# EasyEDA Pro project BEI Kimco Magnetic Cylindrical Frameless Linear Voice Coil Actuator LA15-16-020A.eprj, schematic Schematic1
Board Name: Board1; Create Date: 2025-06-06; Page Name: P1; Project Name: BEI Kimco Magnetic Cylindrical Frameless Linear Voice Coil Actuator LA15-16-020A; Schematic Name: Schematic1; Update Date: 2025-06-13; Company: EasyEDA.com; Page Size: A4; Version: V1.0
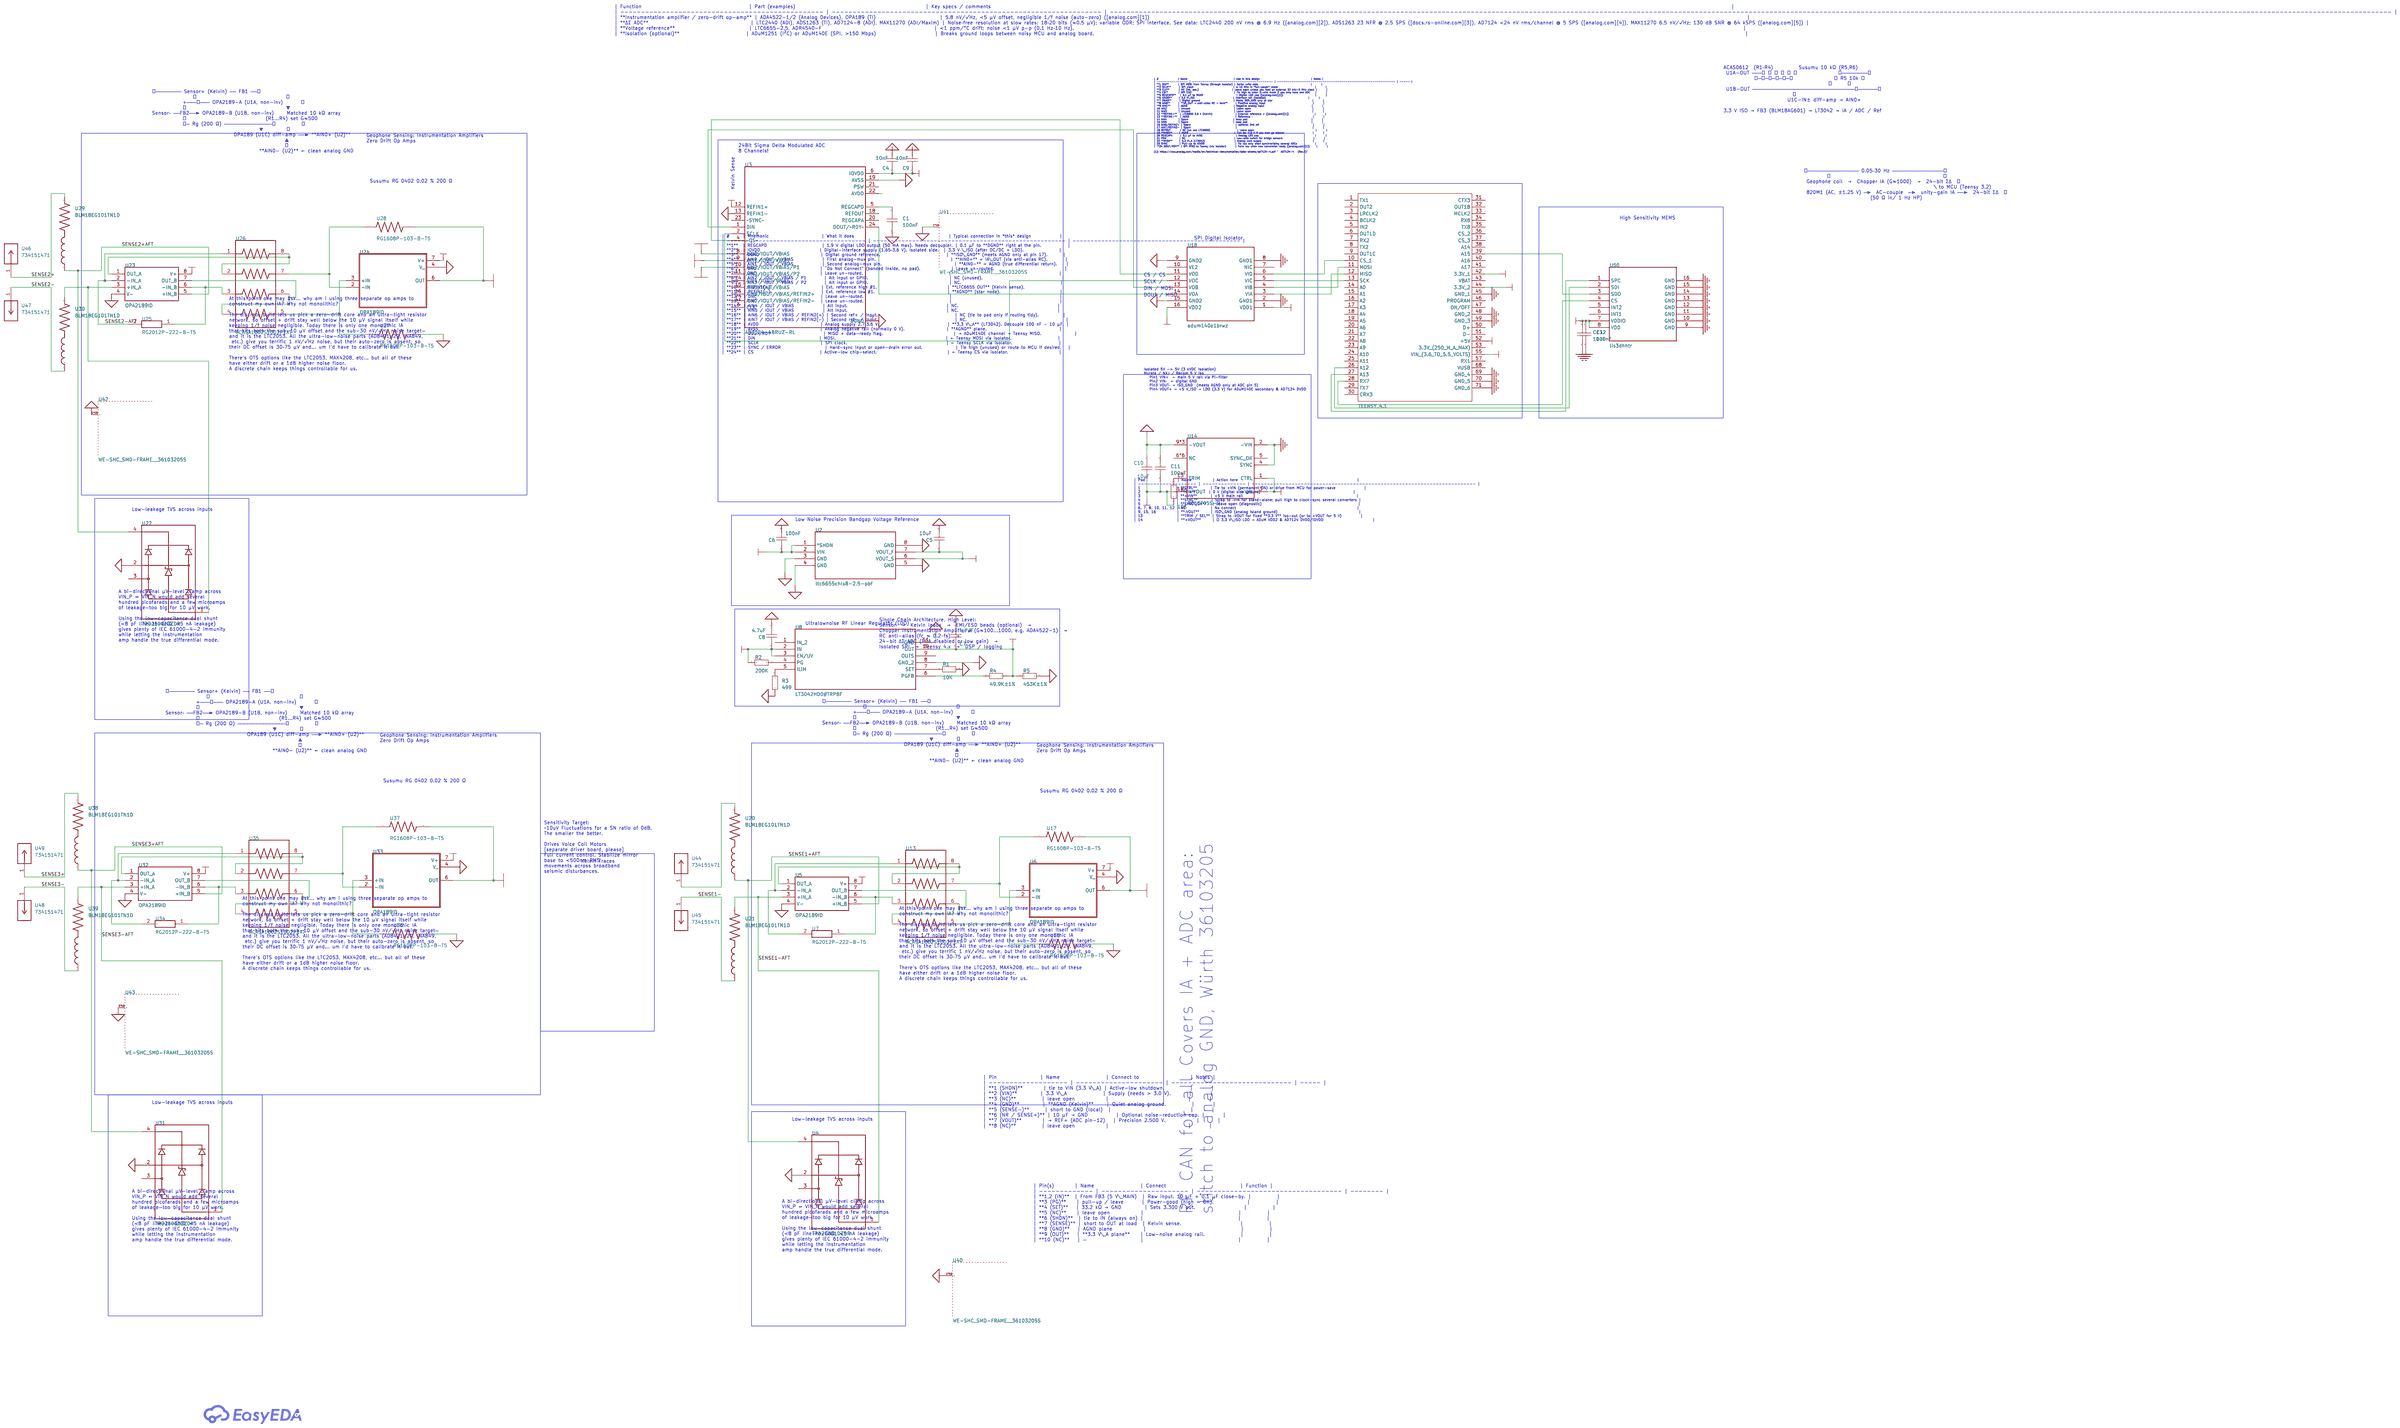
[diagram p0: schematic sheet]

## Parts
C1  100nF  [C0603]
C4  10nF  [C0603]
C5  10uF  [C0603]
C6  100nF  [C0603]
C7  4.7uF  [C0603]
C8  4.7uF  [C0603]
C9  10nF  [C0603]
C10  10uF  [C0603]
C11  100nF  [C0603]
C12  100nF  [C0603]
C13  10uF  [C0603]
R1  10K  [R0603]
R2  200K  [R0603]
R3  499  [R0603]
R4  49.9K±1%  [R0603]
R5  453K±1%  [R0603]
R6  10K  [R0603]
U2  ltc6655chls8-2.5-pbf  [LTC6655CHLS8-2.5-PBF]
U3  AD7124-4BRUZ-RL  [SOP65P640X120-24N]
U4  TPD2E001DZDR  [SOT192P237X122-4N]
U5  OPA2189ID  [SOIC127P600X175-8N]
U6  OPA189ID  [SOIC127P599X175-8N]
U7  RG2012P-222-B-T5  [RESC2012X50N]
U8  LT3042HDD#TRPBF  [DFN-10_DD]
U13  ACASA1002S1002P1AT  [RESCAXS80P320X150X55-8N]
U14  R05CT05S-R  [SOIC127P1030X265-16N]
U16  RG1608P-103-B-T5  [RESC1608X50N]
U17  RG1608P-103-B-T5  [RESC1608X50N]
U18  adum140e1brwz  [ADUM140E1BRWZ]
U20  BLM18EG101TN1D  [BEADC1608X65N]
U21  BLM18EG101TN1D  [BEADC1608X65N]
U22  TPD2E001DZDR  [SOT192P237X122-4N]
U23  OPA2189ID  [SOIC127P600X175-8N]
U24  OPA189ID  [SOIC127P599X175-8N]
U25  RG2012P-222-B-T5  [RESC2012X50N]
U26  ACASA1002S1002P1AT  [RESCAXS80P320X150X55-8N]
U27  RG1608P-103-B-T5  [RESC1608X50N]
U28  RG1608P-103-B-T5  [RESC1608X50N]
U29  BLM18EG101TN1D  [BEADC1608X65N]
U30  BLM18EG101TN1D  [BEADC1608X65N]
U31  TPD2E001DZDR  [SOT192P237X122-4N]
U32  OPA2189ID  [SOIC127P600X175-8N]
U33  OPA189ID  [SOIC127P599X175-8N]
U34  RG2012P-222-B-T5  [RESC2012X50N]
U35  ACASA1002S1002P1AT  [RESCAXS80P320X150X55-8N]
U36  RG1608P-103-B-T5  [RESC1608X50N]
U37  RG1608P-103-B-T5  [RESC1608X50N]
U38  BLM18EG101TN1D  [BEADC1608X65N]
U39  BLM18EG101TN1D  [BEADC1608X65N]
U40  WE-SHC_SMD-FRAME__36103205S  [WE-SHC_SMD-FRAME_36103205S]
U41  WE-SHC_SMD-FRAME__36103205S  [WE-SHC_SMD-FRAME_36103205S]
U42  WE-SHC_SMD-FRAME__36103205S  [WE-SHC_SMD-FRAME_36103205S]
U43  WE-SHC_SMD-FRAME__36103205S  [WE-SHC_SMD-FRAME_36103205S]
U44  734151471  [CONN_734151471_MOL]
U45  734151471  [CONN_734151471_MOL]
U46  734151471  [CONN_734151471_MOL]
U47  734151471  [CONN_734151471_MOL]
U48  734151471  [CONN_734151471_MOL]
U49  734151471  [CONN_734151471_MOL]
U50  lis3dhhtr  [LIS3DHHTR]
U51  TEENSY_4.1  [TEENSY41]

## Library data of the parts
C1 C4-C13 = CAP_0603: Supplier Footprint: 0603
R1-R6 = Res_0603: Supplier Footprint: 0603
U2 = ltc6655chls8-2.5-pbf
U3 = AD7124-4BRUZ-RL
U4 U22 U31 = TPD2E001DZDR
U5 U23 U32 = OPA2189ID
U6 U24 U33 = OPA189ID
U7 U25 U34 = RG2012P-222-B-T5
U8 = LT3042HDD#TRPBF
U13 U26 U35 = ACASA1002S1002P1AT
U14 = R05CT05S-R
U16 U17 U27 U28 U36 U37 = RG1608P-103-B-T5
U18 = adum140e1brwz
U20 U21 U29 U30 U38 U39 = BLM18EG101TN1D
U40-U43 = WE-SHC_SMD-FRAME__36103205S
U44-U49 = 734151471
U50 = lis3dhhtr
U51 = TEENSY_4.1

## Nets
+2.5V: C5.2 U2.6(VOUT_S) U2.7(VOUT_F) U3.12(REFIN1+)
+3.3V_D: C12.2 C13.2 U18.1(VDD1) U50.7(VDDIO) U50.8(VDD) U51.42(3.3V_1) U51.44(3.3V_2)
+3.3VANALOGSIDE: C4.1 C6.2 C7.2 C9.1 R4.2 R5.1 U2.1(*SHDN) U2.2(VIN) U3.6(IOVDD) U5.8(V+) U6.7(V+) U8.10(OUT) U18.16(VDD2) U23.8(V+) U24.7(V+) U32.8(V+) U33.7(V+)
+5V_D: U14.1(CTRL) U14.3(+VIN) U51.52(+5V) U51.55(VIN_(3.6_TO_5.5_VOLTS))
+5V_ISO: C8.2 C10.1 C11.1 R2.1 R6.1 U8.2(IN) U8.3(EN/UV) U14.14(+VOUT)
AGND: C1.2 C4.2 C5.1 C6.1 C7.1 C8.1 C9.2 C10.2 C11.2 R1.2 R3.1 R5.2 U2.3(GND) U2.4(GND) U2.5(GND) U2.8(GND) U3.7(DGND) U3.13(REFIN1-) U3.19(AVSS) U4.2(IO1) U5.4(V-) U6.4(V_) U8.8(GND_2) U8.11(GND) U14.9*3(-VOUT) U16.2 U18.9(GND2) U18.15(GND2) U22.2(IO1) U23.4(V-) U24.4(V_) U27.2 U31.2(IO1) U32.4(V-) U33.4(V_) U36.2 U40.1*16(GND) U41.1*16(GND) U42.1*16(GND) U43.1*16(GND)
DGND: C12.1 C13.1 U14.2(-VIN) U14.4(SYNC) U18.2(GND1) U18.8(GND1) U50.9(GND) U50.10(GND) U50.11(GND) U50.12(GND) U50.13(GND) U50.14(GND) U50.15(GND) U50.16(GND) U51.45(GND_1) U51.48(GND_2) U51.49(GND_3) U51.69(GND_4) U51.70(GND_5) U51.71(GND_6)
SENSE1+AFT: U4.4(VCC) U5.5(+IN_B) U20.1
SENSE1-: U21.1 U45.1
SENSE1-AFT: U4.1(GND) U5.3(+IN_A) U21.2
SENSE2+: U29.2 U46.1
SENSE2+AFT: U22.4(VCC) U23.5(+IN_B) U29.1
SENSE2-: U30.1 U47.1
SENSE2-AFT: U23.2(-IN_A) U25.2 U26.1
SENSE3+: U38.2 U49.1
SENSE3+AFT: U31.4(VCC) U32.5(+IN_B) U38.1
SENSE3-: U39.1 U48.1
SENSE3-AFT: U31.1(GND) U32.3(+IN_A) U39.2
VOUT1: U3.8(AIN0/IOUT/VBIAS) U6.6(OUT) U17.2
VOUT2: U3.9(AIN1/IOUT/VBIAS) U24.6(OUT) U28.2
VOUT3: U3.10(AIN2/IOUT/VBIAS/P1) U33.6(OUT) U37.2
$1N2294: U5.2(-IN_A) U7.2 U13.1
$1N2302: U5.1(OUT_A) U13.2 U13.8
$1N2324: U6.2(-IN) U13.7 U17.1
$1N2345: U5.6(-IN_B) U7.1 U13.3
$1N2364: U5.7(OUT_B) U13.4 U13.6
$1N2371: U6.3(+IN) U13.5 U16.1
$1N2673: U20.2 U44.1
$1N6968: C1.1 U3.5(REGCAPD)
$1N7408: R1.1 U8.7(SET)
$1N7592: R2.2 U8.4(PG)
$1N7629: R3.2 U8.5(ILIM)
$1N7669: R4.1 U8.6(PGFB)
$1N7796: U3.24(DOUT/~RDY~) U18.14(VOA)
$1N7806: U3.1(DIN) U18.13(VOB)
$1N7858: U3.2(SCLK) U18.12(VOC)
$1N12110: U23.1(OUT_A) U26.2 U26.8
$1N12111: U24.2(-IN) U26.7 U28.1
$1N12112: U23.6(-IN_B) U25.1 U26.3
$1N12113: U23.7(OUT_B) U26.4 U26.6
$1N12114: U24.3(+IN) U26.5 U27.1
$1N12117: U22.1(GND) U23.3(+IN_A) U30.2
$1N12421: U32.2(-IN_A) U34.2 U35.1
$1N12422: U32.1(OUT_A) U35.2 U35.8
$1N12423: U33.2(-IN) U35.7 U37.1
$1N12424: U32.6(-IN_B) U34.1 U35.3
$1N12425: U32.7(OUT_B) U35.4 U35.6
$1N12426: U33.3(+IN) U35.5 U36.1
$1N13549: R6.2 U14.13(TRIM)
$1N16488: U18.5(VIC) U51.13(SCK)
$1N16501: U3.4(~CS~) U18.11(VOD)
$1N16511: U18.4(VIB) U51.11(MOSI)
$1N16517: U18.3(VIA) U51.12(MISO)
$1N16524: U18.6(VID) U51.10(CS_1)
$1N16708: U50.1(SPC) U51.27(A13)
$1N16721: U50.2(SDI) U51.26(A12)
$1N16729: U50.3(SDO) U51.39(A15)
$1N16924: U50.4(CS) U51.28(RX7)

Not connected (* = marked no-connect by the designer): U3 3(CLK) 11(AIN3/IOUT/VBIAS/P2) 14(AIN4/IOUT/VBIAS) 15(AIN5/IOUT/VBIAS) 16(AIN6/IOUT/VBIAS/REFIN2+) 17(AIN7/IOUT/VBIAS/REFIN2-) 18(REFOUT) 20(REGCAPA) 21(PSW) 22(AVDD) 23(~SYNC~); U4 3(IO2); U8 1(IN_2) 9(OUTS); U14 5(SYNC_OK) 6*6(NC); U18 7(NIC) 10(VE2); U22 3(IO2); U31 3(IO2); U50 5(INT2) 6(INT1); U51 1(TX1) 2(OUT2) 3(LRCLK2) 4(BCLK2) 5(IN2) 6(OUT1D) 7(RX2) 8(TX2) 9(OUT1C) 14(A0) 15(A1) 16(A2) 17(A3) 18(A4) 19(A5) 20(A6) 21(A7) 22(A8) 23(A9) 24(A10) 25(A11) 29(TX7) 30(CRX3) 31(CTX3) 32(OUT1B) 33(MCLK2) 34(RX8) 35(TX8) 36(CS_2) 37(CS_3) 38(A14) 40(A16) 41(A17) 43(VBAT) 46(PROGRAM) 47(ON/OFF) 50(D+) 51(D-) 53(3.3V_(250_M_A_MAX)) 57(RX1) 68(VUSB)

## Notes on the sheet
- | Function                                          | Part (examples)                                                   | Key specs / comments                                                                                                                                                                                                                                                                                                  |
  | ------------------------------------------------- | ----------------------------------------------------------------- | --------------------------------------------------------------------------------------------------------------------------------------------------------------------------------------------------------------------------------------------------------------------------------------------------------------------- |
  | **Instrumentation amplifier / zero-drift op-amp** | ADA4522-1/2 (Analog Devices), OPA189 (TI)                         | 5.8 nV/√Hz, <5 µV offset, negligible 1/f noise (auto-zero) ([analog.com][1])                                                                                                                                                                                                                                          |
  | **ΔΣ ADC**                                        | LTC2440 (ADI), ADS1263 (TI), AD7124-8 (ADI), MAX11270 (ADI/Maxim) | Noise‐free resolution at slow rates: 18–20 bits (≈0.5 µV); variable ODR; SPI interface. See data: LTC2440 200 nV rms @ 6.9 Hz ([analog.com][2]), ADS1263 23 NFR @ 2.5 SPS ([docs.rs-online.com][3]), AD7124 <24 nV rms/channel @ 5 SPS ([analog.com][4]), MAX11270 6.5 nV/√Hz; 130 dB SNR @ 64 kSPS ([analog.com][5]) |
  | **Voltage reference**                             | LTC6655-2.5, ADR4540-F                                            | <1 ppm/°C drift; noise <1 µV p-p (0.1 Hz–10 Hz).                                                                                                                                                                                                                                                                      |
  | **Isolation (optional)**                          | ADuM1251 (I²C) or ADuM140E (SPI, >150 Mbps)                       | Breaks ground loops between noisy MCU and analog board.                                                                                                                                                                                                                                                               |
- ACAS0612  (R1–R4)          Susumu 10 kΩ (R5,R6)
   U1A-OUT ───┐ │ │ │ │ ┐                ┌────────┐
              └─┴─┴─┴─┴─┘                │ R5 10k │
                                           │      │
   U1B-OUT ────────────────────────────────┴──────┘
                             │
                           U1C-IN± diff-amp → AIN0+
  3.3 V ISO → FB3 (BLM18AG601) → LT3042 → IA / ADC / Ref
- Geophone Sensing: Instrumentation Amplifiers
  Zero Drift Op Amps
- ┌──────── Sensor+ (Kelvin) ── FB1 ──┐
                  │                                   │
              +───┴─── OPA2189-A (U1A, non-inv)       │
              │                                       ▼
  Sensor– ──FB2──► OPA2189-B (U1B, non-inv)     Matched 10 kΩ array
              │                               (R1…R4) set G≈500
              └─ Rg (200 Ω) ───────────────┐          │
                                            ▼         │
                                  OPA189 (U1C) diff-amp ──► **AIN0+ (U2)**
                                                      ▲
                                                      │
                                            **AIN0- (U2)** ← clean analog GND
- 24Bit Sigma Delta Modulated ADC
  8 Channels!
- | #               | Name                                    | Use in this design                                        | Notes |
  | --------------- | --------------------------------------- | --------------------------------------------------------- | ----- |
  | **1 DIN**       | SPI MOSI from Teensy (through isolator) | Serial write data                                         |       |
  | **2 SCLK**      | SPI clock                               | ≤ 10 MHz in *full-power* mode                             |       |
  | **3 CLK**       | NC (int. osc.)                          | Leave open unless you feed an external 32 kHz-5 MHz clock |       |
  | **4 CS**        | SPI CSₙ                                 | Tie high to enter 3-wire mode if you only have one ADC    |       |
  | **5 REGCAPD**   | 0.1 µF to DGND                          | Digital LDO cap ([analog.com][1])                         |       |
  | **6 IOVDD**     | 3.3 V\_ISO                              | Interface rail (isolated)                                 |       |
  | **7 DGND**      | Digital ground                          | Meets ISO\_GND only at star                               |       |
  | **8 AIN0**      | **IA\_OUT → anti-alias RC → here**      | Positive analog input                                     |       |
  | **9 AIN1**      | AGND                                    | Negative analog input                                     |       |
  | 10 AIN2         | Unused                                  | Leave open                                                |       |
  | 11 AIN3         | Unused                                  | Leave open                                                |       |
  | 12 **REFIN1+**  | LTC6655 2.5 V (Kelvin)                  | External reference + ([analog.com][1])                    |       |
  | 13 **REFIN1-**  | AGND                                    | Reference –                                               |       |
  | 14 AIN4         | Spare                                   | keep pad                                                  |       |
  | 15 AIN5         | Spare                                   | keep pad                                                  |       |
  | 16 AIN6/REFIN2+ | Spare                                   | optional 2nd ref                                          |       |
  | 17 AIN7/REFIN2- | Spare                                   |                                                           |       |
  | 18 REFOUT       | NC (we use LTC6655)                     | Leave open                                                |       |
  | 19 **AVSS**     | AGND                                    | Can be –1.8 V if you ever go bipolar                      |       |
  | 20 REGCAPA      | 0.1 µF to AVSS                          | Analog LDO cap                                            |       |
  | 21 PSW          | NC                                      | Low-side switch for bridge sensors                        |       |
  | 22 **AVDD**     | 3.3 V\_A (LT3042)                       | Analog core supply                                        |       |
  | 23 SYNC         | Pull-up to IOVDD                        | Tie low only when synchronising several ADCs              |       |
  | **24 DOUT/RDY** | SPI MISO to Teensy (via isolator)       | Falls low when new conversion ready ([analog.com][1])     |       |
  [1]: https://www.analog.com/media/en/technical-documentation/data-sheets/ad7124-4.pdf "  AD7124-4   (Rev.E)"
- Susumu RG 0402 0.02 % 200 Ω
- Kelvin Sense
- ┌──────────────── 0.05–30 Hz ────────────────┐
           │                                            │
   Geophone coil  →  Chopper IA (G≈1000)  →  24-bit ΣΔ  │
                                                     \ to MCU (Teensy 3.2)
   820M1 (AC, ±1.25 V) ─►  AC-couple  ─►  unity-gain IA ──►  24-bit ΣΔ  ┘
                            (50 Ω in/ 1 Hz HP)
- High Sensitivity MEMS
- SPI Digital Isolator
- CS / CS
- SCLK /
- DIN / MOSI
- DOUT / MISO
- | #      | Mnemonic                        | What it does                                           | Typical connection in *this* design             |
  | ------ | ------------------------------- | ------------------------------------------------------ | ----------------------------------------------- |
  | **1**  | REGCAPD                         | 1.9 V digital LDO output (50 mA max). Needs decoupler. | 0.1 µF to **DGND** right at the pin.            |
  | **2**  | IOVDD                           | Digital-interface supply (1.65–3.6 V). Isolated side.  | 3.3 V \_ISO (after DC/DC + LDO).                |
  | **3**  | DGND                            | Digital ground reference.                              | **ISO\_GND** (meets AGND only at pin 17).       |
  | **4**  | AIN0 / IOUT / VBIAS             | First analog-mux pin.                                  | **AIN0+** = IA\_OUT (via anti-alias RC).        |
  | **5**  | AIN1 / IOUT / VBIAS             | Second analog-mux pin.                                 | **AIN0-** = AGND (true differential return).    |
  | **6**  | DNC                             | “Do Not Connect” (bonded inside, no pad).              | Leave un-routed.                                |
  | **7**  | DNC                             | Leave un-routed.                                       |                                                 |
  | **8**  | AIN2 / IOUT / VBIAS / P1        | Alt input or GPIO.                                     | NC (unused).                                    |
  | **9**  | AIN3 / IOUT / VBIAS / P2        | Alt input or GPIO.                                     | NC.                                             |
  | **10** | REFIN1(+)                       | Ext. reference high #1.                                | **LTC6655 OUT** (Kelvin sense).                 |
  | **11** | REFIN1(−)                       | Ext. reference low #1.                                 | **AGND** (star node).                           |
  | **12** | DNC                             | Leave un-routed.                                       |                                                 |
  | **13** | DNC                             | Leave un-routed.                                       |                                                 |
  | **14** | AIN4 / IOUT / VBIAS             | Alt input.                                             | NC.                                             |
  | **15** | AIN5 / IOUT / VBIAS             | Alt input.                                             | NC.                                             |
  | **16** | AIN6 / IOUT / VBIAS / REFIN2(+) | Second ref+ / input.                                   | NC (tie to pad only if routing tidy).           |
  | **17** | AIN7 / IOUT / VBIAS / REFIN2(−) | Second ref- / input.                                   | NC.                                             |
  | **18** | AVDD                            | Analog supply 2.7–3.6 V.                               | **3.3 V\_A** (LT3042). Decouple 100 nF - 10 µF. |
  | **19** | AVSS                            | Analog negative rail (normally 0 V).                   | **AGND** plane.                                 |
  | **20** | DOUT/RDY                        | MISO + data-ready flag.                                | → ADuM140E channel → Teensy MISO.               |
  | **21** | DIN                             | MOSI.                                                  | ← Teensy MOSI via isolator.                     |
  | **22** | SCLK                            | SPI clock.                                             | ← Teensy SCLK via isolator.                     |
  | **23** | SYNC / ERROR                    | Hard-sync input or open-drain error out.               | Tie high (unused) or route to MCU if desired.   |
  | **24** | CS                              | Active-low chip-select.                                | ← Teensy CS via isolator.                       |
- At this point one may ask... why am i using three separate op amps to
  construct my own IA? Why not monolithic?
  The discrete build lets us pick a zero-drift core and an ultra-tight resistor
  network, so offset + drift stay well below the 10 µV signal itself while
  keeping 1/f noise negligible. Today there is only one monolithic IA
  that hits both the sub-10 µV offset and the sub-30 nV/√Hz noise target—
  and it is the LTC2053. All the ultra-low-noise parts (AD8421/29, INA849,
   etc.) give you terrific 1 nV/√Hz noise, but their auto-zero is absent, so
  their DC offset is 30–75 µV and... um I'd have to calibrate it out.
  There's OTS options like the LTC2053, MAX4208, etc... but all of these
  have either drift or a 1dB higher noise floor.
  A discrete chain keeps things controllable for us.
- Isolated 5V -> 5V (3 kVDC Isolation)
  Murata / NXJ / Recom 5 V iso
     Pin1 VIN+  ← main 5 V rail via Pi-filter
     Pin2 VIN–  ← digital GND
     Pin3 VOUT– → ISO_GND  (meets AGND only at ADC pin 5)
     Pin4 VOUT+ → +5 V_ISO → LDO (3.3 V) for ADuM140E secondary & AD7124 DVDD
- Low-leakage TVS across inputs
- Low Noise Precision Bandgap Voltage Reference
- | Pad                 | Name           | Action here                                                               |
  | ------------------- | -------------- | ------------------------------------------------------------------------- |
  | 1                   | **CTRL**       | Tie to +VIN (permanent ON) or drive from MCU for power-save               |
  | 2                   | **–VIN**       | 0 V (digital side ground)                                                 |
  | 3                   | **+VIN**       | +5 V main rail                                                            |
  | 4                   | **SYNC**       | Strap to –VIN for stand-alone; pull high to clock-sync several converters |
  | 5                   | **SYNC\_OK**   | Leave open (diagnostic)                                                   |
  | 6, 7, 8, 10, 11, 12 | NC             | No connect                                                                |
  | 9, 15, 16           | **–VOUT**      | ISO\_GND (analog island ground)                                           |
  | 13                  | **TRIM / SEL** | Strap to –VOUT for fixed **3.3 V** iso-out (or to +VOUT for 5 V)          |
  | 14                  | **+VOUT**      | ➜ 3.3 V\_ISO LDO → ADuM VDD2 & AD7124 DVDD/IOVDD                          |
- Ultralownoise RF Linear Regulator (LDO)
- A bi-directional µV-level clamp across
  VIN_P ↔ VIN_N would add several
  hundred picofarads and a few microamps
  of leakage—too big for 10 µV work.
  Using the low-capacitance dual shunt
  (<8 pF line-to-GND, <5 nA leakage)
  gives plenty of IEC 61000-4-2 immunity
  while letting the instrumentation
  amp handle the true differential mode.
- Single Chain Architecture, High Level:
  Sensor  →  Kelvin leads  →  EMI/ESD beads (optional)  →
  Chopper Instrumentation Amplifier A (G≈100…1000, e.g. ADA4522-1)  →
  RC anti-alias (fc ≈ 0.2·fs)  →
  24-bit ΔΣ ADC (PGA disabled or low gain)  →
  Isolated SPI  →  Teensy 4.x  →  DSP / logging
- Geophone Sensing: Instrumentation Amplifiers
  Zero Drift Op Amps
- ┌──────── Sensor+ (Kelvin) ── FB1 ──┐
                  │                                   │
              +───┴─── OPA2189-A (U1A, non-inv)       │
              │                                       ▼
  Sensor– ──FB2──► OPA2189-B (U1B, non-inv)     Matched 10 kΩ array
              │                               (R1…R4) set G≈500
              └─ Rg (200 Ω) ───────────────┐          │
                                            ▼         │
                                  OPA189 (U1C) diff-amp ──► **AIN0+ (U2)**
                                                      ▲
                                                      │
                                            **AIN0- (U2)** ← clean analog GND
- Geophone Sensing: Instrumentation Amplifiers
  Zero Drift Op Amps
- ┌──────── Sensor+ (Kelvin) ── FB1 ──┐
                  │                                   │
              +───┴─── OPA2189-A (U1A, non-inv)       │
              │                                       ▼
  Sensor– ──FB2──► OPA2189-B (U1B, non-inv)     Matched 10 kΩ array
              │                               (R1…R4) set G≈500
              └─ Rg (200 Ω) ───────────────┐          │
                                            ▼         │
                                  OPA189 (U1C) diff-amp ──► **AIN0+ (U2)**
                                                      ▲
                                                      │
                                            **AIN0- (U2)** ← clean analog GND
- Susumu RG 0402 0.02 % 200 Ω
- Susumu RG 0402 0.02 % 200 Ω
- Kelvin Traces
- Sensitivity Target:
  ~10uV Fluctuations for a SN ratio of 0dB.
  The smaller the better.
  Drives Voice Coil Motors
  [separate driver board, please]
  Full current control. Stabilize mirror
  base to <500nm RMS
  movements across broadband
  seismic disturbances.
- At this point one may ask... why am i using three separate op amps to
  construct my own IA? Why not monolithic?
  The discrete build lets us pick a zero-drift core and an ultra-tight resistor
  network, so offset + drift stay well below the 10 µV signal itself while
  keeping 1/f noise negligible. Today there is only one monolithic IA
  that hits both the sub-10 µV offset and the sub-30 nV/√Hz noise target—
  and it is the LTC2053. All the ultra-low-noise parts (AD8421/29, INA849,
   etc.) give you terrific 1 nV/√Hz noise, but their auto-zero is absent, so
  their DC offset is 30–75 µV and... um I'd have to calibrate it out.
  There's OTS options like the LTC2053, MAX4208, etc... but all of these
  have either drift or a 1dB higher noise floor.
  A discrete chain keeps things controllable for us.
- At this point one may ask... why am i using three separate op amps to
  construct my own IA? Why not monolithic?
  The discrete build lets us pick a zero-drift core and an ultra-tight resistor
  network, so offset + drift stay well below the 10 µV signal itself while
  keeping 1/f noise negligible. Today there is only one monolithic IA
  that hits both the sub-10 µV offset and the sub-30 nV/√Hz noise target—
  and it is the LTC2053. All the ultra-low-noise parts (AD8421/29, INA849,
   etc.) give you terrific 1 nV/√Hz noise, but their auto-zero is absent, so
  their DC offset is 30–75 µV and... um I'd have to calibrate it out.
  There's OTS options like the LTC2053, MAX4208, etc... but all of these
  have either drift or a 1dB higher noise floor.
  A discrete chain keeps things controllable for us.
- Low-leakage TVS across inputs
- Low-leakage TVS across inputs
- | Pin                 | Name                  | Connect to                    | Notes |
  | ------------------- | --------------------- | ----------------------------- | ----- |
  | **1 (SHDN)**        | tie to VIN (3.3 V\_A) | Active-low shutdown.          |       |
  | **2 (VIN)**         | 3.3 V\_A              | Supply (needs > 3.0 V).       |       |
  | **3 (NC)**          | leave open            |                               |       |
  | **4 (GND)**         | **AGND (Kelvin)**     | Quiet analog ground.          |       |
  | **5 (SENSE−)**      | short to GND (local)  |                               |       |
  | **6 (NR / SENSE+)** | 10 µF → GND           | Optional noise-reduction cap. |       |
  | **7 (VOUT)**        | → REF+ (ADC pin-12)   | Precision 2.500 V.            |       |
  | **8 (NC)**          | leave open            |                               |       |
- RF CAN for all Covers IA + ADC area:
  stitch to analog GND, Würth 36103205
- A bi-directional µV-level clamp across
  VIN_P ↔ VIN_N would add several
  hundred picofarads and a few microamps
  of leakage—too big for 10 µV work.
  Using the low-capacitance dual shunt
  (<8 pF line-to-GND, <5 nA leakage)
  gives plenty of IEC 61000-4-2 immunity
  while letting the instrumentation
  amp handle the true differential mode.
- | Pin(s)        | Name                  | Connect                             | Function |
  | ------------- | --------------------- | ----------------------------------- | -------- |
  | **1,2 (IN)**  | From FB3 (5 V\_MAIN)  | Raw input. 10 µF + 0.1 µF close-by. |          |
  | **3 (PG)**    | pull-up / leave       | Power-good (high = OK).             |          |
  | **4 (SET)**   | 33.2 kΩ → GND         | Sets 3.300 V out.                   |          |
  | **5 (NC)**    | leave open            |                                     |          |
  | **6 (SHDN)**  | tie to IN (always on) |                                     |          |
  | **7 (SENSE)** | short to OUT at load  | Kelvin sense.                       |          |
  | **8 (GND)**   | AGND plane            |                                     |          |
  | **9 (OUT)**   | **3.3 V\_A plane**    | Low-noise analog rail.              |          |
  | **10 (NC)**   | —                     |                                     |          |
- A bi-directional µV-level clamp across
  VIN_P ↔ VIN_N would add several
  hundred picofarads and a few microamps
  of leakage—too big for 10 µV work.
  Using the low-capacitance dual shunt
  (<8 pF line-to-GND, <5 nA leakage)
  gives plenty of IEC 61000-4-2 immunity
  while letting the instrumentation
  amp handle the true differential mode.
